# EAGLE design IREncoder (EAGLE 9.2.2)
Wheel Encoder for Senior Design This schematic is for the IR receiver/transmitter for the wheel encoders
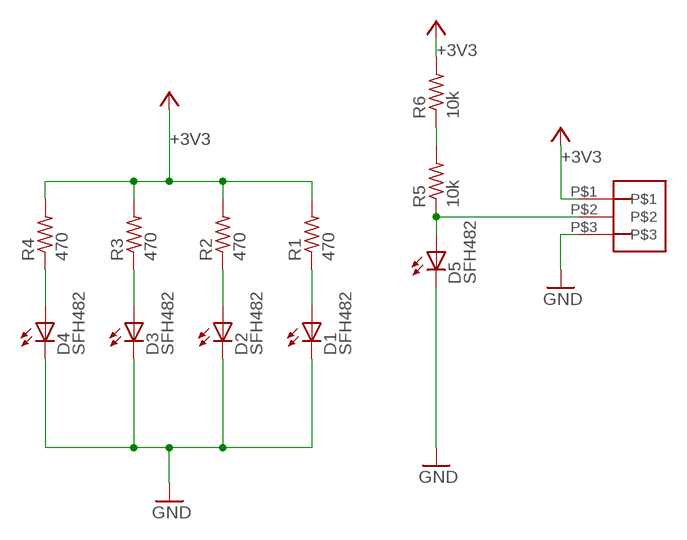
[diagram p0: schematic, sheet 1]

## Parts
D1  SFH482  [SFH482]
D2  SFH482  [SFH482]
D3  SFH482  [SFH482]
D4  SFH482  [SFH482]
D5  SFH482  [SFH482]
J1  3_PIN_JST-XH  [3_PIN_JST-XH]
R1  470  R-US_R0805  [R0805]
R2  470  R-US_R0805  [R0805]
R3  470  R-US_R0805  [R0805]
R4  470  R-US_R0805  [R0805]
R5  10k  R-US_R0805  [R0805]
R6  10k  R-US_R0805  [R0805]

## Nets
+3V3: J1.P$1 R1.2 R2.2 R3.2 R4.2 R6.2 ; supply symbol labelled +5V
GND: D1.K(C) D2.K(C) D3.K(C) D4.K(C) D5.K(C) J1.P$3
N$1: D4.A R4.1
N$2: D3.A R3.1
N$3: D2.A R2.1
N$4: D1.A R1.1
N$5: D5.A J1.P$2 R5.1
N$6: R5.2 R6.1

## Library data of the parts
D1-D5 = led:SFH482: IR LED infrared emitting diode, Infineon
J1 = DMF-con_JST_XH_dmf:3_PIN_JST-XH: Corrected for XH 3 pin dmf 4.10.15 Source info: http://www.jst-mfg.com/product/pdf/eng/eXH.pdf Note: pin spacing is 2.5 mm Note: pins are 0.64 mm square cross section. This means the pin diagonal is 0.905 mm. Hole diameter spec'd by jst is 0.9 mm; hole diameter used here is 1.0 mm
R1-R6 = rcl:R-US_: RESISTOR, American symbol; SPICEPREFIX: R

## Board
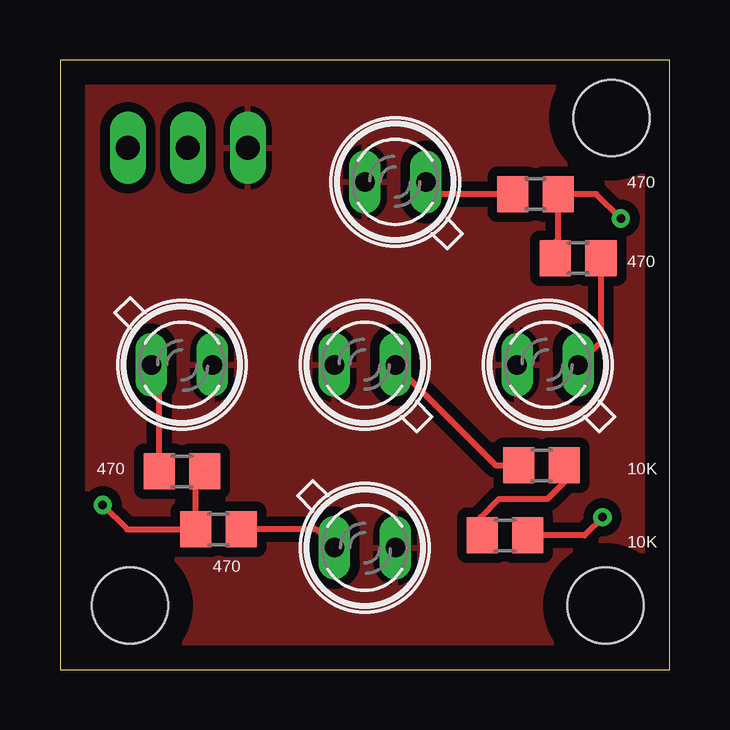
[diagram p1: board, top side]
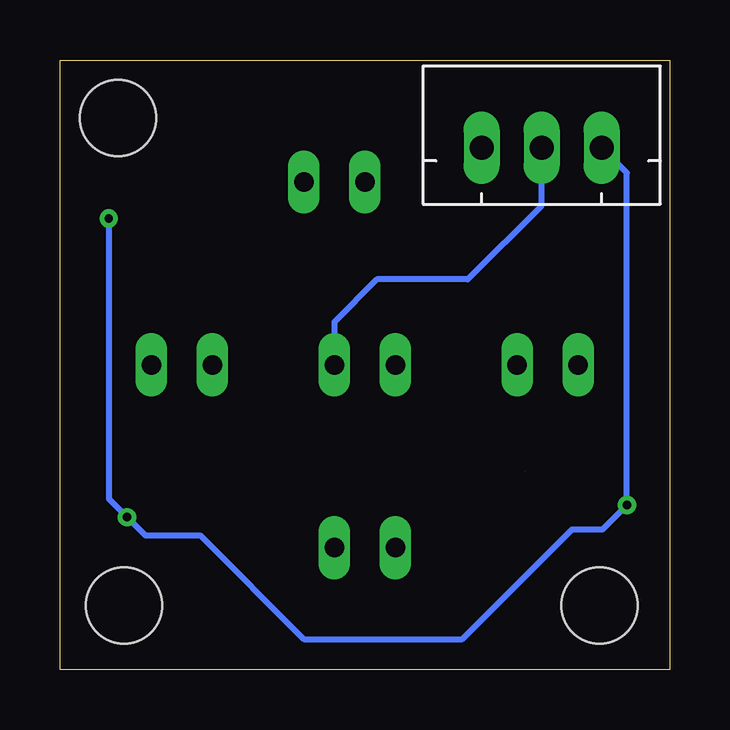
[diagram p2: board, bottom side, seen from below]

Size 25.4 x 25.4 mm. Coordinates in mm from the lower left corner, seen from the top.
Outline: 0,0 25.4,0 25.4,25.4 0,25.4 0,0
Copper layers (1*16): Top 0.035mm / dielectric 1.5mm / Bottom 0.035mm
Design rules "default": minimum track width 6mil, minimum drill 0.35mm, track to track 6mil, track to pad 6mil, pad to pad 6mil, via to via 6mil, smd to smd 6mil, copper to edge 40mil, drill to drill 6mil, minimum pad ring 10mil, minimum via ring 8mil, stop-mask expansion 4mil, vias tented up to drill 0mil, thermal gap 10mil
Holes 3.17 mm at 2.92,2.67 22.73,2.67 22.99,22.99

### Footprints (pad centres in the part's own frame; a part is rotated, then mirrored left to right if it is on the bottom)
SFH482 = drill 0.813 long: A -1.27,0; K 1.27,0
3_PIN_JST-XH = drill 1 long: P$1 2.45,3.4; P$2 4.95,3.4; P$3 7.45,3.4
R0805 = smd 1.3 x 1.5: 1 -0.95,0; 2 0.95,0

### Placement (x,y rotation side)
D1  12.7,5.08 0 top
D2  5.08,12.7 0 top
D3  13.97,20.32 180 top
D4  20.32,12.7 180 top
D5  12.7,12.7 180 top
J1  0.38,25.15 180 bottom
R1  6.6,5.84 180 top
R2  5.08,8.26 0 top
R3  19.81,19.81 0 top
R4  21.59,17.14 180 top
R5  20.07,8.51 0 top
R6  18.54,5.59 0 top

### Tracks (layer width: path | path; a pad name or v marks a point on that pad's centre or on a via)
+3V3  (via drill 0.35)  (1 unrouted)
  Top 0.254: R4.2 20.64,17.79 20.76,17.99 R3.2 22.35,19.81 v23.37,18.8 | R2.2 5.65,7.88 R1.2 2.79,5.84 v1.78,6.86 | v22.61,6.35 21.84,5.59 R6.2 | R2.2 5.65,8.64
  Bottom 0.254: v23.37,18.8 23.37,7.11 v22.61,6.35 21.84,5.59 19.56,5.59 15.24,1.27 8.64,1.27 4.06,5.84 2.79,5.84 v1.78,6.86 1.78,20.69 J1.P$1
GND
  pour Top (isolate 0.406): 0,25.4 0,0 25.4,0 25.4,25.4
N$1
  Top 0.254: R4.1 22.54,13.65 D4.A
N$2
  Top 0.254: R3.1 15.75,19.81 D3.A
N$3
  Top 0.254: R2.1 4.13,12.38 D2.A
N$4
  Top 0.254: D1.A 10.67,5.84 R1.1
N$5
  Top 0.254: D5.A 18.16,8.51 R5.1
  Bottom 0.254: J1.P$2 5.33,19.34 8.41,16.26 12.19,16.26 13.97,14.48 D5.A
N$6
  Top 0.254: R6.1 17.53,5.65 17.53,6.35 18.29,7.11 20.32,7.11 21.02,7.81 R5.2

### Text on the board
tPlace: 470 | 470 | 470 | 10K | 10K | 470